# Altium schematic sheet 11-GPS.SchDoc
size A4
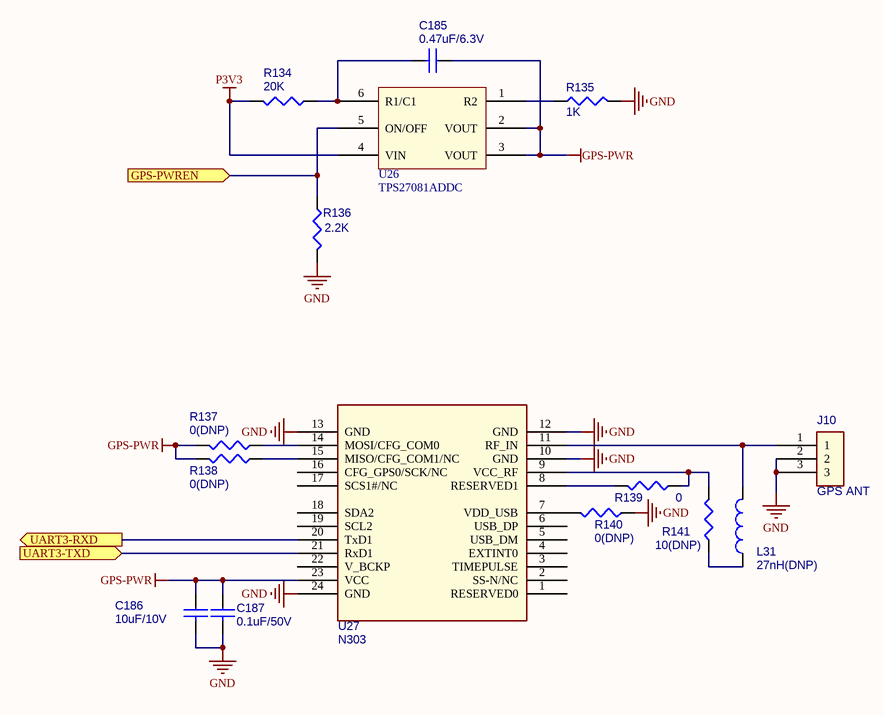
[diagram p0: 11-GPS.SchDoc]

## Parts
C185  0.47uF/6.3V  [0402]
C186  10uF/10V  [0805]
C187  0.1uF/50V  [0402]
J10  GPS ANT  [ANT]
L31  27nH(DNP)  [0603]
R134  20K  [0402]
R135  1K  [0402]
R136  2.2K  [0402]
R137  0(DNP)  [0402]
R138  0(DNP)  [0402]
R139  0  [0402]
R140  0(DNP)  [0402]
R141  10(DNP)  [0402]
U26  TPS27081ADDC  [SOT23-6]
U27  N303  [NEO-6]

## Ports
GPS-PWREN (in), UART3-RXD (out), UART3-TXD (in)

## Nets
GND: C186.2 C187.2 J10.2 J10.3 R135.1 R136.1 R140.1 U27.10(GND) U27.12(GND) U27.13(GND) U27.24(GND)
GPS-PWR: C185.1 C186.1 C187.1 R137.2 R138.2 U26.2(VOUT) U26.3(VOUT) U27.23(VCC)
P3V3: R134.1 U26.4(VIN)
GPS-PWREN: R136.2 U26.5(ON/OFF) ; port GPS-PWREN
UART3-RXD: U27.20(TxD1) ; port UART3-RXD
UART3-TXD: U27.21(RxD1) ; port UART3-TXD
NetC185_2: C185.2 R134.2 U26.6(R1/C1)
NetJ10_1: J10.1 L31.2 U27.11(RF_IN)
NetL31_1: L31.1 R141.1
NetR135_2: R135.2 U26.1(R2)
NetR137_1: R137.1 U27.14(MOSI/CFG_COM0)
NetR138_1: R138.1 U27.15(MISO/CFG_COM1/NC)
NetR139_1: R139.1 R141.2 U27.9(VCC_RF)
NetR139_2: R139.2 U27.8(RESERVED1)
NetR140_2: R140.2 U27.7(VDD_USB)

Not connected (* = marked no-connect by the designer): U27 1(RESERVED0) 2(SS-N/NC) 3(TIMEPULSE) 4(EXTINT0) 5(USB_DM) 6(USB_DP) 16(CFG_GPS0/SCK/NC) 17(SCS1#/NC) 18(SDA2) 19(SCL2) 22(V_BCKP)

## Library data of the parts
C185-C187 = P_CAP NP
J10 = HRS_U_0.FL-R-SMT-10
L31 = 2.2UH_LPS3015-222MLC_1.5A_20%~D
R134-R141 = P_R
U26 = TPS27081A
U27 = NEO-5M